# Altium schematic sheet Input Voltage Sense.SchDoc
size A3
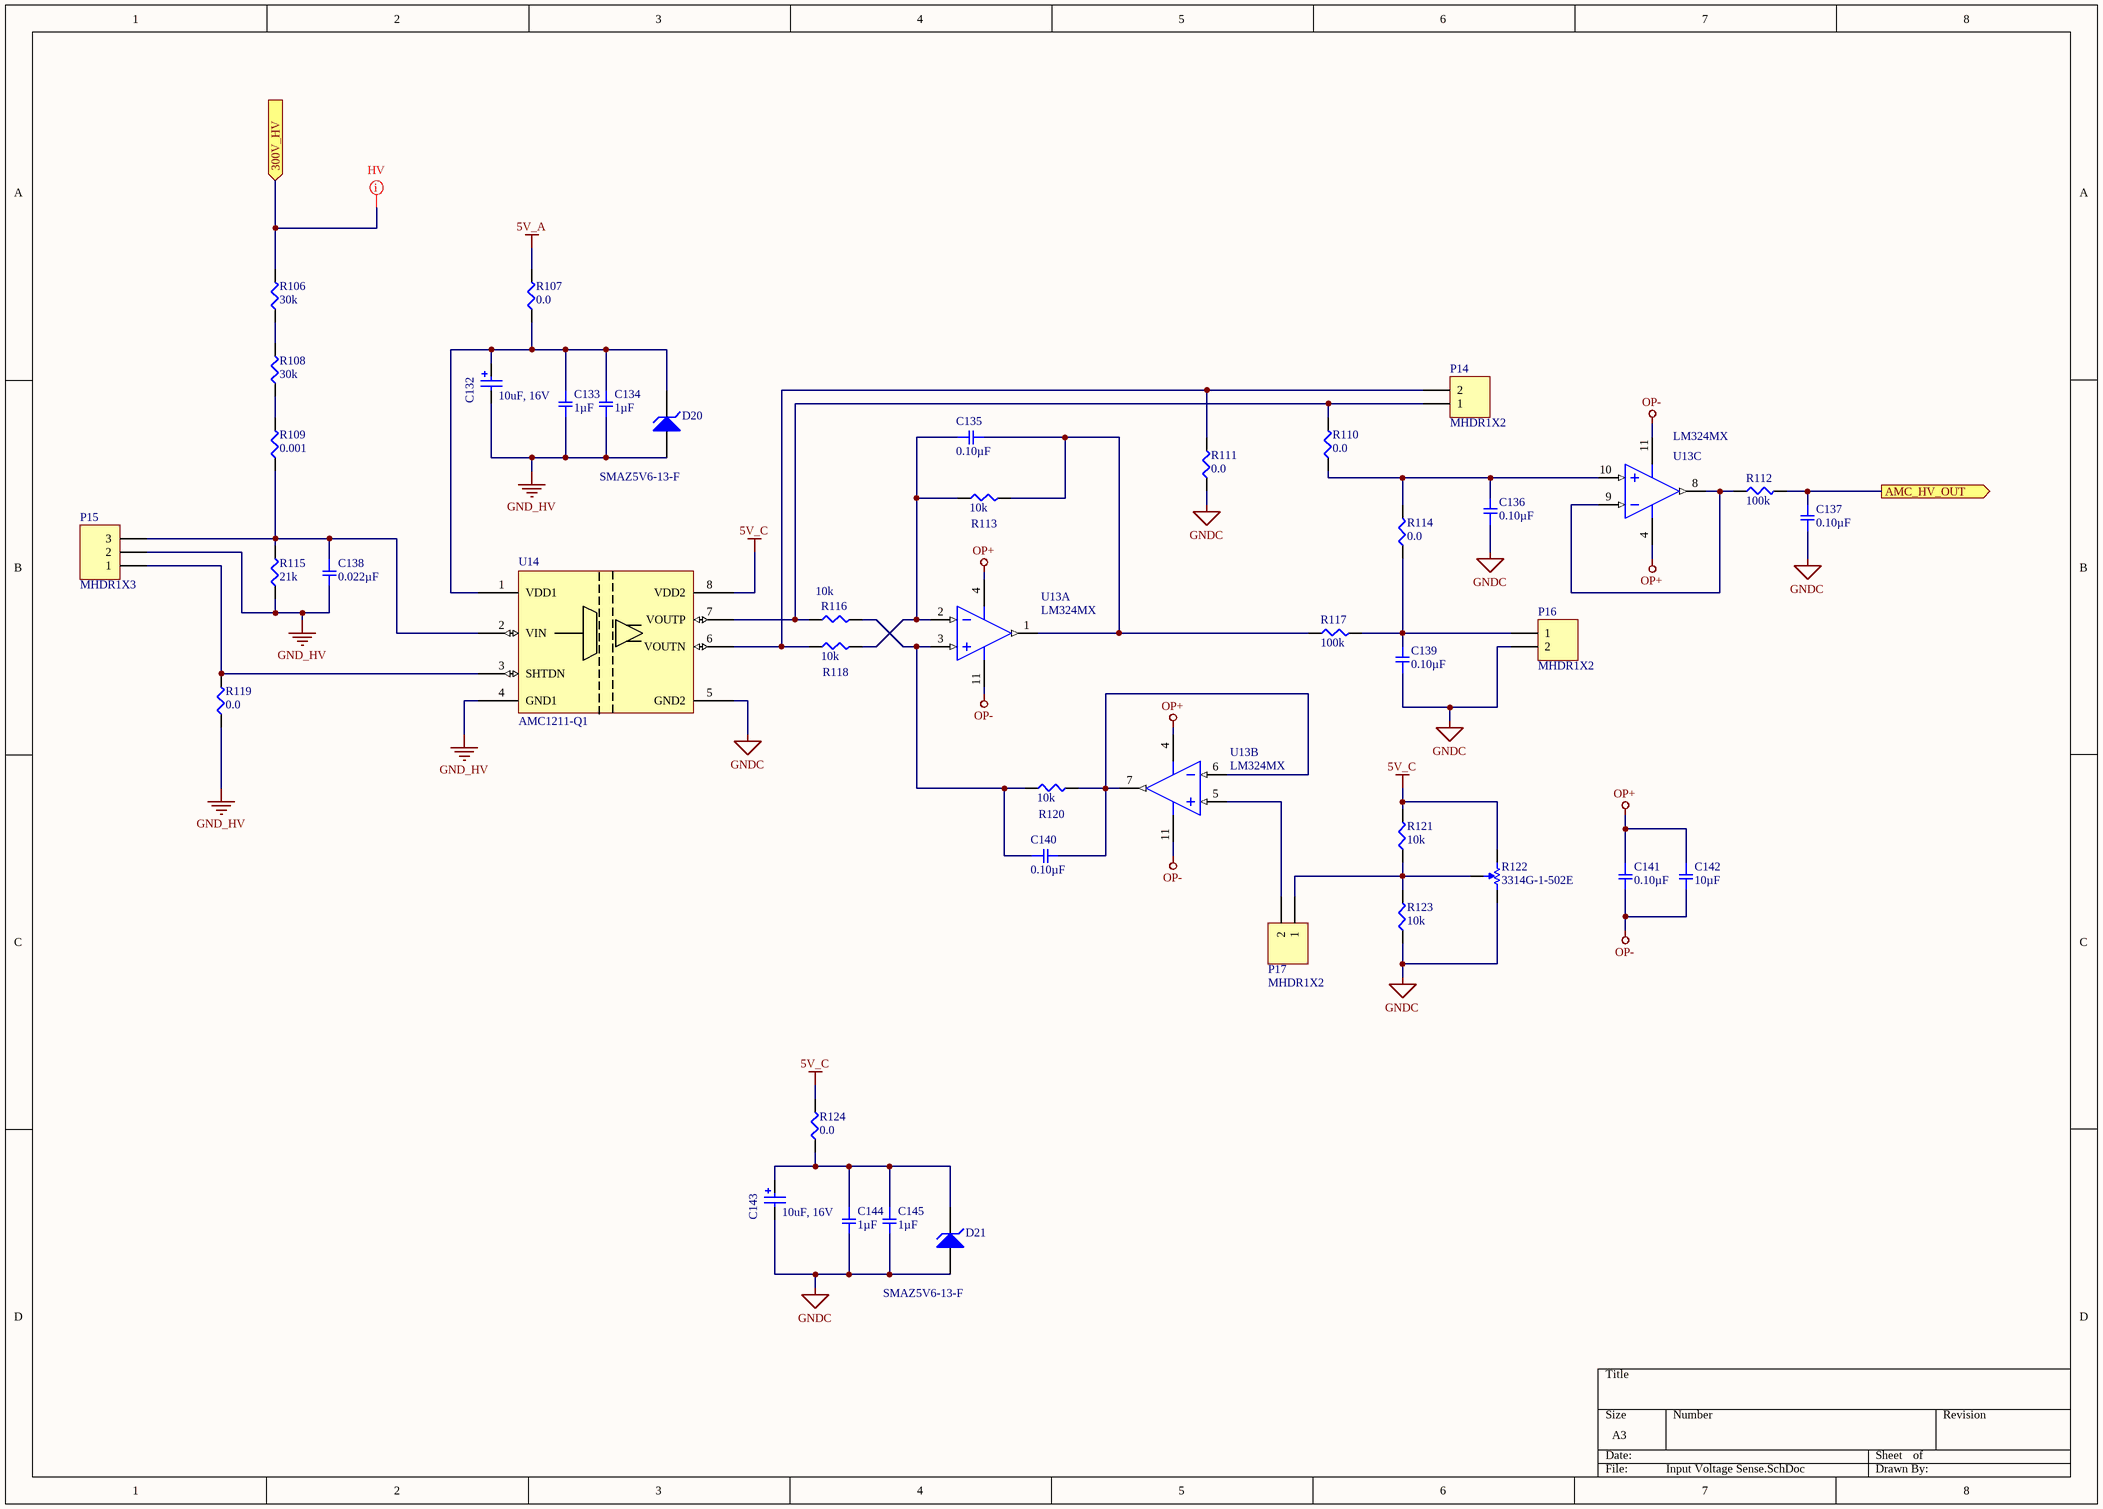
[diagram p0: Input Voltage Sense.SchDoc]

## Parts
C132  10uF, 16V  [WCAP-ASLU_3x5.5]
C133  1µF  [SMD-0805C]
C134  1µF  [SMD-0805C]
C135  0.10µF  [SMD-0603C]
C136  0.10µF  [SMD-0603C]
C137  0.10µF  [SMD-0603C]
C138  0.022µF  [SMD-1206C]
C139  0.10µF  [SMD-0603C]
C140  0.10µF  [SMD-0603C]
C141  0.10µF  [SMD-0805C]
C142  10µF  [SMD-0805C]
C143  10uF, 16V  [WCAP-ASLU_3x5.5]
C144  1µF  [SMD-0805C]
C145  1µF  [SMD-0805C]
D20  SMAZ5V6-13-F  [DIOD-SMA-2_V]
D21  SMAZ5V6-13-F  [DIOD-SMA-2_V]
P14  MHDR1X2  [MHDR1X2]
P15  MHDR1X3  [MHDR1X3]
P16  MHDR1X2  [MHDR1X2]
P17  MHDR1X2  [MHDR1X2]
R106  30k  [SMD-2512-RES]
R107  0.0  [SMD-1206-RES]
R108  30k  [SMD-2512-RES]
R109  0.001  [SMD-2512-RES]
R110  0.0  [SMD-0603-RES]
R111  0.0  [SMD-0603-RES]
R112  100k  [SMD-0603-RES]
R113  10k  [SMD-0603-RES]
R114  0.0  [SMD-0603-RES]
R115  21k  [SMD-1206-RES]
R116  10k  [SMD-0603-RES]
R117  100k  [SMD-0603-RES]
R118  10k  [SMD-0603-RES]
R119  0.0  [SMD-1206-RES]
R120  10k  [SMD-0603-RES]
R121  10k  [SMD-0603-RES]
R122  3314G-1-502E  [BOUR-3314G-1_V]
R123  10k  [SMD-0603-RES]
R124  0.0  [SMD-1206-RES]
U13  LM324MX  [D0014A_L]  (parts A,B,C of 4)
U14  AMC1211-Q1  [SOIC127P570X175_HS-9N]

## Ports
300V_HV (in), AMC_HV_OUT (out)

## Nets
5V_A: R107.2
5V_C: R121.2 R122.1 R124.2 U14.8(VDD2)
GND_HV: C132.1(N) C133.2 C134.2 C138.2 D20.1(A) P15.2 R115.1 R119.1 U14.4(GND1)
GNDC: C136.1 C137.1 C139.1 C143.1(N) C144.2 C145.2 D21.1(A) P16.2 R111.1 R122.3 R123.1 U14.5(GND2)
OP+: C141.1 C142.1 U13.4(V+)
OP-: C141.2 C142.2 U13.11(GND)
300V_HV: R106.2 ; port 300V_HV
AMC_HV_OUT: C137.2 R112.2 ; port AMC_HV_OUT
NetC132_2: C132.2(P) C133.1 C134.1 D20.2(K) R107.1 U14.1(VDD1)
NetC135_1: C135.1 R113.1 R118.2 U13.2(IN1-)
NetC135_2: C135.2 R113.2 R117.1 U13.1(OUT1)
NetC136_2: C136.2 R110.1 R114.2 U13.10(IN3+)
NetC138_1: C138.1 P15.3 R109.1 R115.2 U14.2(VIN)
NetC139_2: C139.2 P16.1 R114.1 R117.2
NetC140_1: C140.1 R116.2 R120.1 U13.3(IN1+)
NetC140_2: C140.2 R120.2 U13.6(IN2-) U13.7(OUT2)
NetC143_2: C143.2(P) C144.1 C145.1 D21.2(K) R124.1
NetP14_1: P14.1 R110.2 R116.1 U14.7(VOUTP)
NetP14_2: P14.2 R111.2 R118.1 U14.6(VOUTN)
NetP15_1: P15.1 R119.2 U14.3(SHTDN)
NetP17_1: P17.1 R121.1 R122.2 R123.2
NetP17_2: P17.2 U13.5(IN2+)
NetR106_1: R106.1 R108.2
NetR108_1: R108.1 R109.2
NetR112_1: R112.1 U13.8(OUT3) U13.9(IN3-)

## Layout directives
rule Clearance Constraint [Generic clearance = 50mil, and 18 value(s) for objects]: 300V_HV

## Library data of the parts
C132 C143 = 865090368008: WCAP-ASLU Aluminium Electrolytic Capacitors, D3mm x L5.5mm, 10uF, +/-20%, 16VDC; Dissipation Factor: 18%; Leakage Current: 3uA; Endurance: 2000h; Technical Reference: ASBA055100M016DVCTAB000; Ripple Current max.: 20mA; ComponentLink1Description: Manufacturer; ComponentLink1URL: http://www.we-online.de; ComponentLink2Description: Datasheet; ComponentLink2URL: https://katalog.we-online.com/pbs/datasheet/865090368008.pdf; Mounting Technology: SMD; Operating Temperature: -40 to +85degC; Packaging: Tape and Reel; Part Number: 865090368008; Publisher: Wurth Elektronik; Capacitance: 10uF; Diameter: 3mm; Length: 5.5mm; Published Date: August 2019; Rated Voltage: 16VDC; Capacitance Tolerance: +/-20%
C133 C134 C144 C145 = GCM219R71C105KA37D: CAP CER 1UF 16V X7R 0805; Manufacturer: Murata Electronics North America; Factory Stock: 0; Unit Price (USD): 0.17; Minimum Quantity: 1; Tolerance: ±10%; Datasheets: http://www.murata.com/~/media/webrenewal/support/library/catalog/products/capacitor/mlcc/c03e.ashx; Image: //media.digikey.com/photos/Murata%20Photos/NCP,GCM%20SERIES%200805.jpg; Digi-Key Part Number: 490-8043-1-ND; Part Number: GCM219R71C105KA37D; Quantity Available: 11770; @ qty: 0; Packaging: Cut Tape (CT); Series: GCM; Part Status: Active; Value: 1µF; Voltage: 16V; Temperature Coefficient: X7R; Operating Temperature: -55°C ~ 125°C; Features: -; Ratings: AEC-Q200; Applications: Automotive; Mounting Type: Surface Mount, MLCC; Package / Case: 0805 (2012 Metric); Size / Dimension: 0.079" L x 0.049" W (2.00mm x 1.25mm); Height - Seated (Max): -; Thickness (Max): 0.037" (0.95mm); Lead Spacing: -; Lead Style: -
C135-C137 C139 C140 = GCJ188R72A104KA01D: CAP CER 0.1UF 100V X7R 0603; Manufacturer: Murata Electronics North America; Factory Stock: 0; Unit Price (USD): 0.23; Minimum Quantity: 1; Tolerance: ±10%; Datasheets: http://www.murata.com/~/media/webrenewal/support/library/catalog/products/capacitor/mlcc/c03e.ashx; Image: //media.digikey.com/Renders/Murata%20Renders/0603%28LQG18%29.jpg; Digi-Key Part Number: 490-13420-1-ND; Part Number: GCJ188R72A104KA01D; Quantity Available: 2728; @ qty: 0; Packaging: Cut Tape (CT); Series: GCJ; Part Status: Active; Value: 0.10µF; Voltage: 100V; Temperature Coefficient: X7R; Operating Temperature: -55°C ~ 125°C; Features: Soft Termination; Ratings: AEC-Q200; Applications: Automotive, Boardflex Sensitive; Mounting Type: Surface Mount, MLCC; Package / Case: 0603 (1608 Metric); Size / Dimension: 0.063" L x 0.031" W (1.60mm x 0.80mm); Height - Seated (Max): -; Thickness (Max): 0.035" (0.90mm); Lead Spacing: -; Lead Style: -
C138 = GCM3195C1H223JA16D: CAP CER 0.022UF 50V NP0 1206; Manufacturer: Murata Electronics North America; Factory Stock: 0; Unit Price (USD): 0.53; Minimum Quantity: 1; Tolerance: ±5%; Temperature Coefficient: C0G, NP0; Datasheets: http://www.murata.com/~/media/webrenewal/support/library/catalog/products/capacitor/mlcc/c03e.ashx; Image: //media.digikey.com/Renders/Murata%20Renders/GR331BD72E473KW01L.jpg; Digi-Key Part Number: 490-4790-1-ND; Part Number: GCM3195C1H223JA16D; Quantity Available: 10124; @ qty: 0; Packaging: Cut Tape (CT); Series: GCM; Part Status: Active; Value: 0.022µF; Voltage: 50V; Operating Temperature: -55°C ~ 125°C; Features: -; Ratings: AEC-Q200; Applications: Automotive; Mounting Type: Surface Mount, MLCC; Package / Case: 1206 (3216 Metric); Size / Dimension: 0.126" L x 0.063" W (3.20mm x 1.60mm); Height - Seated (Max): -; Thickness (Max): 0.037" (0.95mm); Lead Spacing: -; Lead Style: -
C141 = GCD21BR71H104KA01L: CAP CER 0.1UF 50V X7R 0805; Manufacturer: Murata Electronics North America; Factory Stock: 0; Unit Price (USD): 0.24; Minimum Quantity: 1; Tolerance: ±10%; Datasheets: http://www.murata.com/~/media/webrenewal/support/library/catalog/products/capacitor/mlcc/c03e.ashx; Image: //media.digikey.com/Renders/Murata%20Renders/0805%28GxM6%29.jpg; Digi-Key Part Number: 490-11955-1-ND; Part Number: GCD21BR71H104KA01L; Quantity Available: 157; @ qty: 0; Packaging: Cut Tape (CT); Series: GCD; Part Status: Active; Value: 0.10µF; Voltage: 50V; Temperature Coefficient: X7R; Operating Temperature: -55°C ~ 125°C; Features: -; Ratings: AEC-Q200; Applications: Automotive; Mounting Type: Surface Mount, MLCC; Package / Case: 0805 (2012 Metric); Size / Dimension: 0.079" L x 0.049" W (2.00mm x 1.25mm); Height - Seated (Max): -; Thickness (Max): 0.049" (1.25mm); Lead Spacing: -; Lead Style: -
C142 = GCJ21BR71A106KE01L: CAP CER 10UF 10V X7R 0805; Manufacturer: Murata Electronics North America; Factory Stock: 0; Unit Price (USD): 0.56; Minimum Quantity: 1; Tolerance: ±10%; Datasheets: http://www.murata.com/~/media/webrenewal/support/library/catalog/products/capacitor/mlcc/c03e.ashx; Image: //media.digikey.com/Renders/Murata%20Renders/0805%20(2012%20Metric)%20.85mm.jpg; Digi-Key Part Number: 490-12646-1-ND; Part Number: GCJ21BR71A106KE01L; Quantity Available: 2702; @ qty: 0; Packaging: Cut Tape (CT); Series: GCJ; Part Status: Active; Value: 10µF; Voltage: 10V; Temperature Coefficient: X7R; Operating Temperature: -55°C ~ 125°C; Features: Soft Termination; Ratings: AEC-Q200; Applications: Automotive, Boardflex Sensitive; Mounting Type: Surface Mount, MLCC; Package / Case: 0805 (2012 Metric); Size / Dimension: 0.079" L x 0.049" W (2.00mm x 1.25mm); Height - Seated (Max): -; Thickness (Max): 0.057" (1.45mm); Lead Spacing: -; Lead Style: -
D20 D21 = CMP-2000-07092-1: Zener Diode, 1 W, 5.6 V, -65 to 150 degC, 2-Pin SMA, RoHS, Tape and Reel; Zz - Zener Impedance: 2Ohms; Ir - Reverse Current: 5uA; Brand: DiodesIncorporated; Vz - Zener Voltage: 5.6V; Pd - Power Dissipation: 1W; Voltage Tolerance: 5%; Unit Weight: 0.002258oz; Vf - Forward Voltage: 1.2Vat200mA; Configuration: Single; Product: ZenerDiode; Zener Current: 5uA; Datasheet URL: http://www.diodes.com/_files/datasheets/ds18015.pdf; Package Reference: SMA-2; Mounting Technology: SurfaceMount; Product Category: ZenerDiodes; Factory Pack Quantity: 5000; Datasheet Version: Rev. 18-2, 04/2016; Package Description: 2-Pin Surface Mounted Assembly, Body 4.3 x 2.605 mm, Height 2.4 mm; Width: 2.92mm; Manufacturer: DiodesIncorporated; Height: 2.09mm; Length: 4.6mm; Mounting Style: SMD/SMT; Series: SMAZ5; Package / Case: SMA-2; Minimum Operating Temperature: -65C; Termination Style: SMD/SMT; Maximum Operating Temperature: +150C; RoHS: True; Manufacturer URL: http://www.diodes.com/; Packaging: Reel
P14 P16 P17 = MHDR1X2: Header, 2-Pin; LatestRevisionDate: 17-Jul-2002; LatestRevisionNote: Re-released for DXP Platform.; Publisher: Altium Limited
P15 = MHDR1X3: Header, 3-Pin; LatestRevisionDate: 17-Jul-2002; LatestRevisionNote: Re-released for DXP Platform.; Publisher: Altium Limited
R106 R108 = ERJ-1TYJ303U: RES SMD 30K OHM 5% 1W 2512; Manufacturer: Panasonic Electronic Components; Factory Stock: 0; Unit Price (USD): 0.07603; @ qty: 1500; Minimum Quantity: 1; Temperature Coefficient: ±200ppm/°C; Part Number: ERJ-1TYJ303U; Datasheets: //media.digikey.com/pdf/Data%20Sheets/Panasonic%20Resistors%20Thermistors%20PDFs/ERJ-xG,14,12(Z),1T_Rev_Apr_2015.pdf; Image: //media.digikey.com/Renders/Panasonic%20Renders/ERJ-2512%20Pkg.jpg; Digi-Key Part Number: PT30KXCT-ND; Quantity Available: 7362; Packaging: Cut Tape (CT); Series: ERJ; Part Status: Active; Value: 30k; Tolerance: ±5%; Power (Watts): 1W; Composition: Thick Film; Features: Automotive AEC-Q200; Operating Temperature: -55°C ~ 155°C; Package / Case: 2512 (6432 Metric); Supplier Device Package: 2512; Size / Dimension: 0.252" L x 0.126" W (6.40mm x 3.20mm); Height - Seated (Max): 0.028" (0.70mm); Number of Terminations: 2; Failure Rate: -
R107 R119 R124 = ERJ-8GEY0R00V: RES SMD 0.0 OHM JUMPER 1/4W 1206; Manufacturer: Panasonic Electronic Components; Factory Stock: 0; Unit Price (USD): 0.00768; @ qty: 1500; Minimum Quantity: 1; Power (Watts): 0.25W, 1/4W; Part Number: ERJ-8GEY0R00V; Datasheets: http://industrial.panasonic.com/www-cgi/jvcr13pz.cgi?E+PZ+3+AOA0001+ERJ8GEY0R00V+7+WW; Image: //media.digikey.com/Renders/Panasonic%20Renders/ERJ-1206%20Pkg.jpg; Digi-Key Part Number: P0.0ECT-ND; Quantity Available: 1074190; Packaging: Cut Tape (CT); Series: ERJ; Part Status: Active; Value: 0.0; Tolerance: Jumper; Composition: Thick Film; Features: Automotive AEC-Q200; Temperature Coefficient: -; Operating Temperature: -55°C ~ 155°C; Package / Case: 1206 (3216 Metric); Supplier Device Package: 1206; Size / Dimension: 0.126" L x 0.063" W (3.20mm x 1.60mm); Height - Seated (Max): 0.028" (0.70mm); Number of Terminations: 2; Failure Rate: -
R109 = ERJ-MS4SF1M0U: RES SMD 0.001 OHM 1% 3W 2512; Manufacturer: Panasonic Electronic Components; Factory Stock: 0; Unit Price (USD): 0.41555; @ qty: 1500; Minimum Quantity: 1; Temperature Coefficient: ±75ppm/°C; Part Number: ERJ-MS4SF1M0U; Datasheets: https://industrial.panasonic.com/cdbs/www-data/pdf/RDA0000/AOA0000C266.pdf; Image: //media.digikey.com/Photos/Panasonic%20Elect%20Works%20Photos/MFG_ERJ-MS4.jpg; Digi-Key Part Number: P17089CT-ND; Quantity Available: 1960; Packaging: Cut Tape (CT); Series: ERJ; Part Status: Active; Value: 0.001; Tolerance: ±1%; Power (Watts): 3W; Composition: Metal Element; Features: Automotive AEC-Q200, Current Sense, Moisture Resistant; Operating Temperature: -65°C ~ 170°C; Package / Case: 2512 (6432 Metric); Supplier Device Package: 2512; Size / Dimension: 0.252" L x 0.126" W (6.40mm x 3.20mm); Height - Seated (Max): 0.053" (1.35mm); Number of Terminations: 2; Failure Rate: -
R110 R111 R114 = ERJ-3GEY0R00V: RES SMD 0.0OHM JUMPER 1/10W 0603; Manufacturer: Panasonic Electronic Components; Factory Stock: 0; Unit Price (USD): 0.00352; @ qty: 1500; Minimum Quantity: 1; Power (Watts): 0.1W, 1/10W; Part Number: ERJ-3GEY0R00V; Datasheets: http://industrial.panasonic.com/www-cgi/jvcr13pz.cgi?E+PZ+3+AOA0001+ERJ3GEY0R00V+7+WW; Image: //media.digikey.com/Photos/Panasonic%20Photos/MFG_ERJ-P6W%20Series.jpg; Digi-Key Part Number: P0.0GCT-ND; Quantity Available: 4813372; Packaging: Cut Tape (CT); Series: ERJ; Part Status: Active; Value: 0.0; Tolerance: Jumper; Composition: Thick Film; Features: Automotive AEC-Q200; Temperature Coefficient: -; Operating Temperature: -55°C ~ 155°C; Package / Case: 0603 (1608 Metric); Supplier Device Package: 0603; Size / Dimension: 0.063" L x 0.031" W (1.60mm x 0.80mm); Height - Seated (Max): 0.022" (0.55mm); Number of Terminations: 2; Failure Rate: -
R112 R117 = ERJ-3EKF1003V: RES SMD 100K OHM 1% 1/10W 0603; Manufacturer: Panasonic Electronic Components; Factory Stock: 0; Unit Price (USD): 0.00379; @ qty: 1500; Minimum Quantity: 1; Power (Watts): 0.1W, 1/10W; Temperature Coefficient: ±100ppm/°C; Part Number: ERJ-3EKF1003V; Datasheets: http://industrial.panasonic.com/www-cgi/jvcr13pz.cgi?E+PZ+3+AOA0002+ERJ3EKF1003V+7+WW; Image: //media.digikey.com/Photos/Panasonic%20Photos/MFG_ERJ-P6W%20Series.jpg; Digi-Key Part Number: P100KHCT-ND; Quantity Available: 2179804; Packaging: Cut Tape (CT); Series: ERJ; Part Status: Active; Value: 100k; Tolerance: ±1%; Composition: Thick Film; Features: Automotive AEC-Q200; Operating Temperature: -55°C ~ 155°C; Package / Case: 0603 (1608 Metric); Supplier Device Package: 0603; Size / Dimension: 0.063" L x 0.031" W (1.60mm x 0.80mm); Height - Seated (Max): 0.022" (0.55mm); Number of Terminations: 2; Failure Rate: -
R113 R116 R118 R120 R121 R123 = ERJ-3EKF1002V: RES SMD 10K OHM 1% 1/10W 0603; Manufacturer: Panasonic Electronic Components; Factory Stock: 0; Unit Price (USD): 0.00379; @ qty: 1500; Minimum Quantity: 1; Power (Watts): 0.1W, 1/10W; Temperature Coefficient: ±100ppm/°C; Part Number: ERJ-3EKF1002V; Datasheets: http://industrial.panasonic.com/www-cgi/jvcr13pz.cgi?E+PZ+3+AOA0002+ERJ3EKF1002V+7+WW; Image: //media.digikey.com/Photos/Panasonic%20Photos/MFG_ERJ-P6W%20Series.jpg; Digi-Key Part Number: P10.0KHCT-ND; Quantity Available: 6703141; Packaging: Cut Tape (CT); Series: ERJ; Part Status: Active; Value: 10k; Tolerance: ±1%; Composition: Thick Film; Features: Automotive AEC-Q200; Operating Temperature: -55°C ~ 155°C; Package / Case: 0603 (1608 Metric); Supplier Device Package: 0603; Size / Dimension: 0.063" L x 0.031" W (1.60mm x 0.80mm); Height - Seated (Max): 0.022" (0.55mm); Number of Terminations: 2; Failure Rate: -
R115 = ERJ-8ENF2102V: RES SMD 21K OHM 1% 1/4W 1206; Manufacturer: Panasonic Electronic Components; Factory Stock: 0; Unit Price (USD): 0.00933; @ qty: 1500; Minimum Quantity: 1; Power (Watts): 0.25W, 1/4W; Temperature Coefficient: ±100ppm/°C; Part Number: ERJ-8ENF2102V; Datasheets: http://industrial.panasonic.com/www-cgi/jvcr13pz.cgi?E+PZ+3+AOA0002+ERJ8ENF2102V+7+WW; Image: //media.digikey.com/Renders/Panasonic%20Renders/ERJ-1206%20Pkg.jpg; Digi-Key Part Number: P21.0KFCT-ND; Quantity Available: 44556; Packaging: Cut Tape (CT); Series: ERJ; Part Status: Active; Value: 21k; Tolerance: ±1%; Composition: Thick Film; Features: Automotive AEC-Q200; Operating Temperature: -55°C ~ 155°C; Package / Case: 1206 (3216 Metric); Supplier Device Package: 1206; Size / Dimension: 0.126" L x 0.063" W (3.20mm x 1.60mm); Height - Seated (Max): 0.028" (0.70mm); Number of Terminations: 2; Failure Rate: -
R122 = CMP-2000-05589-1: 4 mm Square Trimpot(R) Trimming Potentiometer, 5 KOhm, +/- 20%, 0.25 W, -55 to 125 degC, 3-Pin SMD, RoHS, Tape and Reel; Manufacturer: Bourns; Power: 250; Angle of rotation: 240°; Dielectric strength: 500; Resistance: 5; Curve: linear; Package Description: 3-Pin Surface Mount Device, Body 4.5 x 4.5 mm, Pitch 1.15 mm; Package Reference: 3314G-1; Mounting Technology: SurfaceMount; Datasheet URL: http://www.bourns.com/docs/Product-Datasheets/3314.pdf; Datasheet Version: 05/2016; Tolerance: ±20%; Manufacturer URL: http://www.bourns.com/; Temperature range: -55...+125°C; Package: GullWing
U13 = CMP-0055-00741-3: Low Power Quad Operational Amplifier, 14-pin Narrow SOIC; Manufacturer: Texas Instruments; PowerWise: N; CompType: Amplifiers; PackageTopMarking: NSUZXYTTE#*LM324M; Package Reference: D0014A; ComponentLink1URL: http://www.ti.com/general/docs/lit/getliterature.tsp?genericPartNumber=LM324-N&fileType=pdf; PinCount: 14; PackageDescription: Molded Package S.O., .150in Wide, 14 Lead; Code_JEDEC: MS-012AB; Code_IPC: SOIC127P600-14; ComponentLink1Description: Datasheet URL; RoHS: N